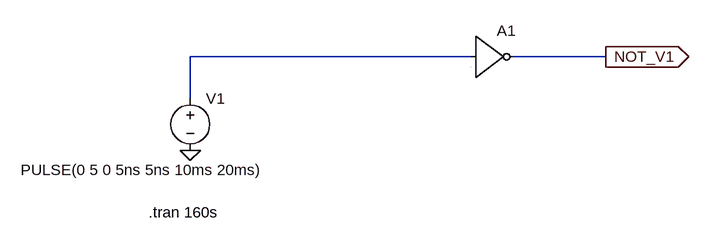
[diagram p0: schematic not gate.asc]
not gate.asc, the LTspice schematic file:
Version 4
SHEET 1 1080 680
WIRE 400 80 -32 80
WIRE 608 80 464 80
WIRE -32 144 -32 80
FLAG -32 224 0
FLAG 608 80 NOT_V1
IOPIN 608 80 Out
SYMBOL voltage -32 128 R0
WINDOW 3 -261 126 Left 2
WINDOW 123 0 0 Left 0
WINDOW 39 0 0 Left 0
SYMATTR InstName V1
SYMATTR Value PULSE(0 5 0 5ns 5ns 10ms 20ms)
SYMBOL Digital\\inv 400 16 R0
SYMATTR InstName A1
TEXT -96 320 Left 2 !.tran 160s

The netlist it stands for:
* not gate.asc
V1 N001 0 PULSE(0 5 0 5ns 5ns 10ms 20ms)
A1 N001 0 0 0 0 NOT_V1 0 0 BUF
.tran 160s
.backanno
.end